# EAGLE schematic led-matrix-displayCompl (EAGLE 5.12)
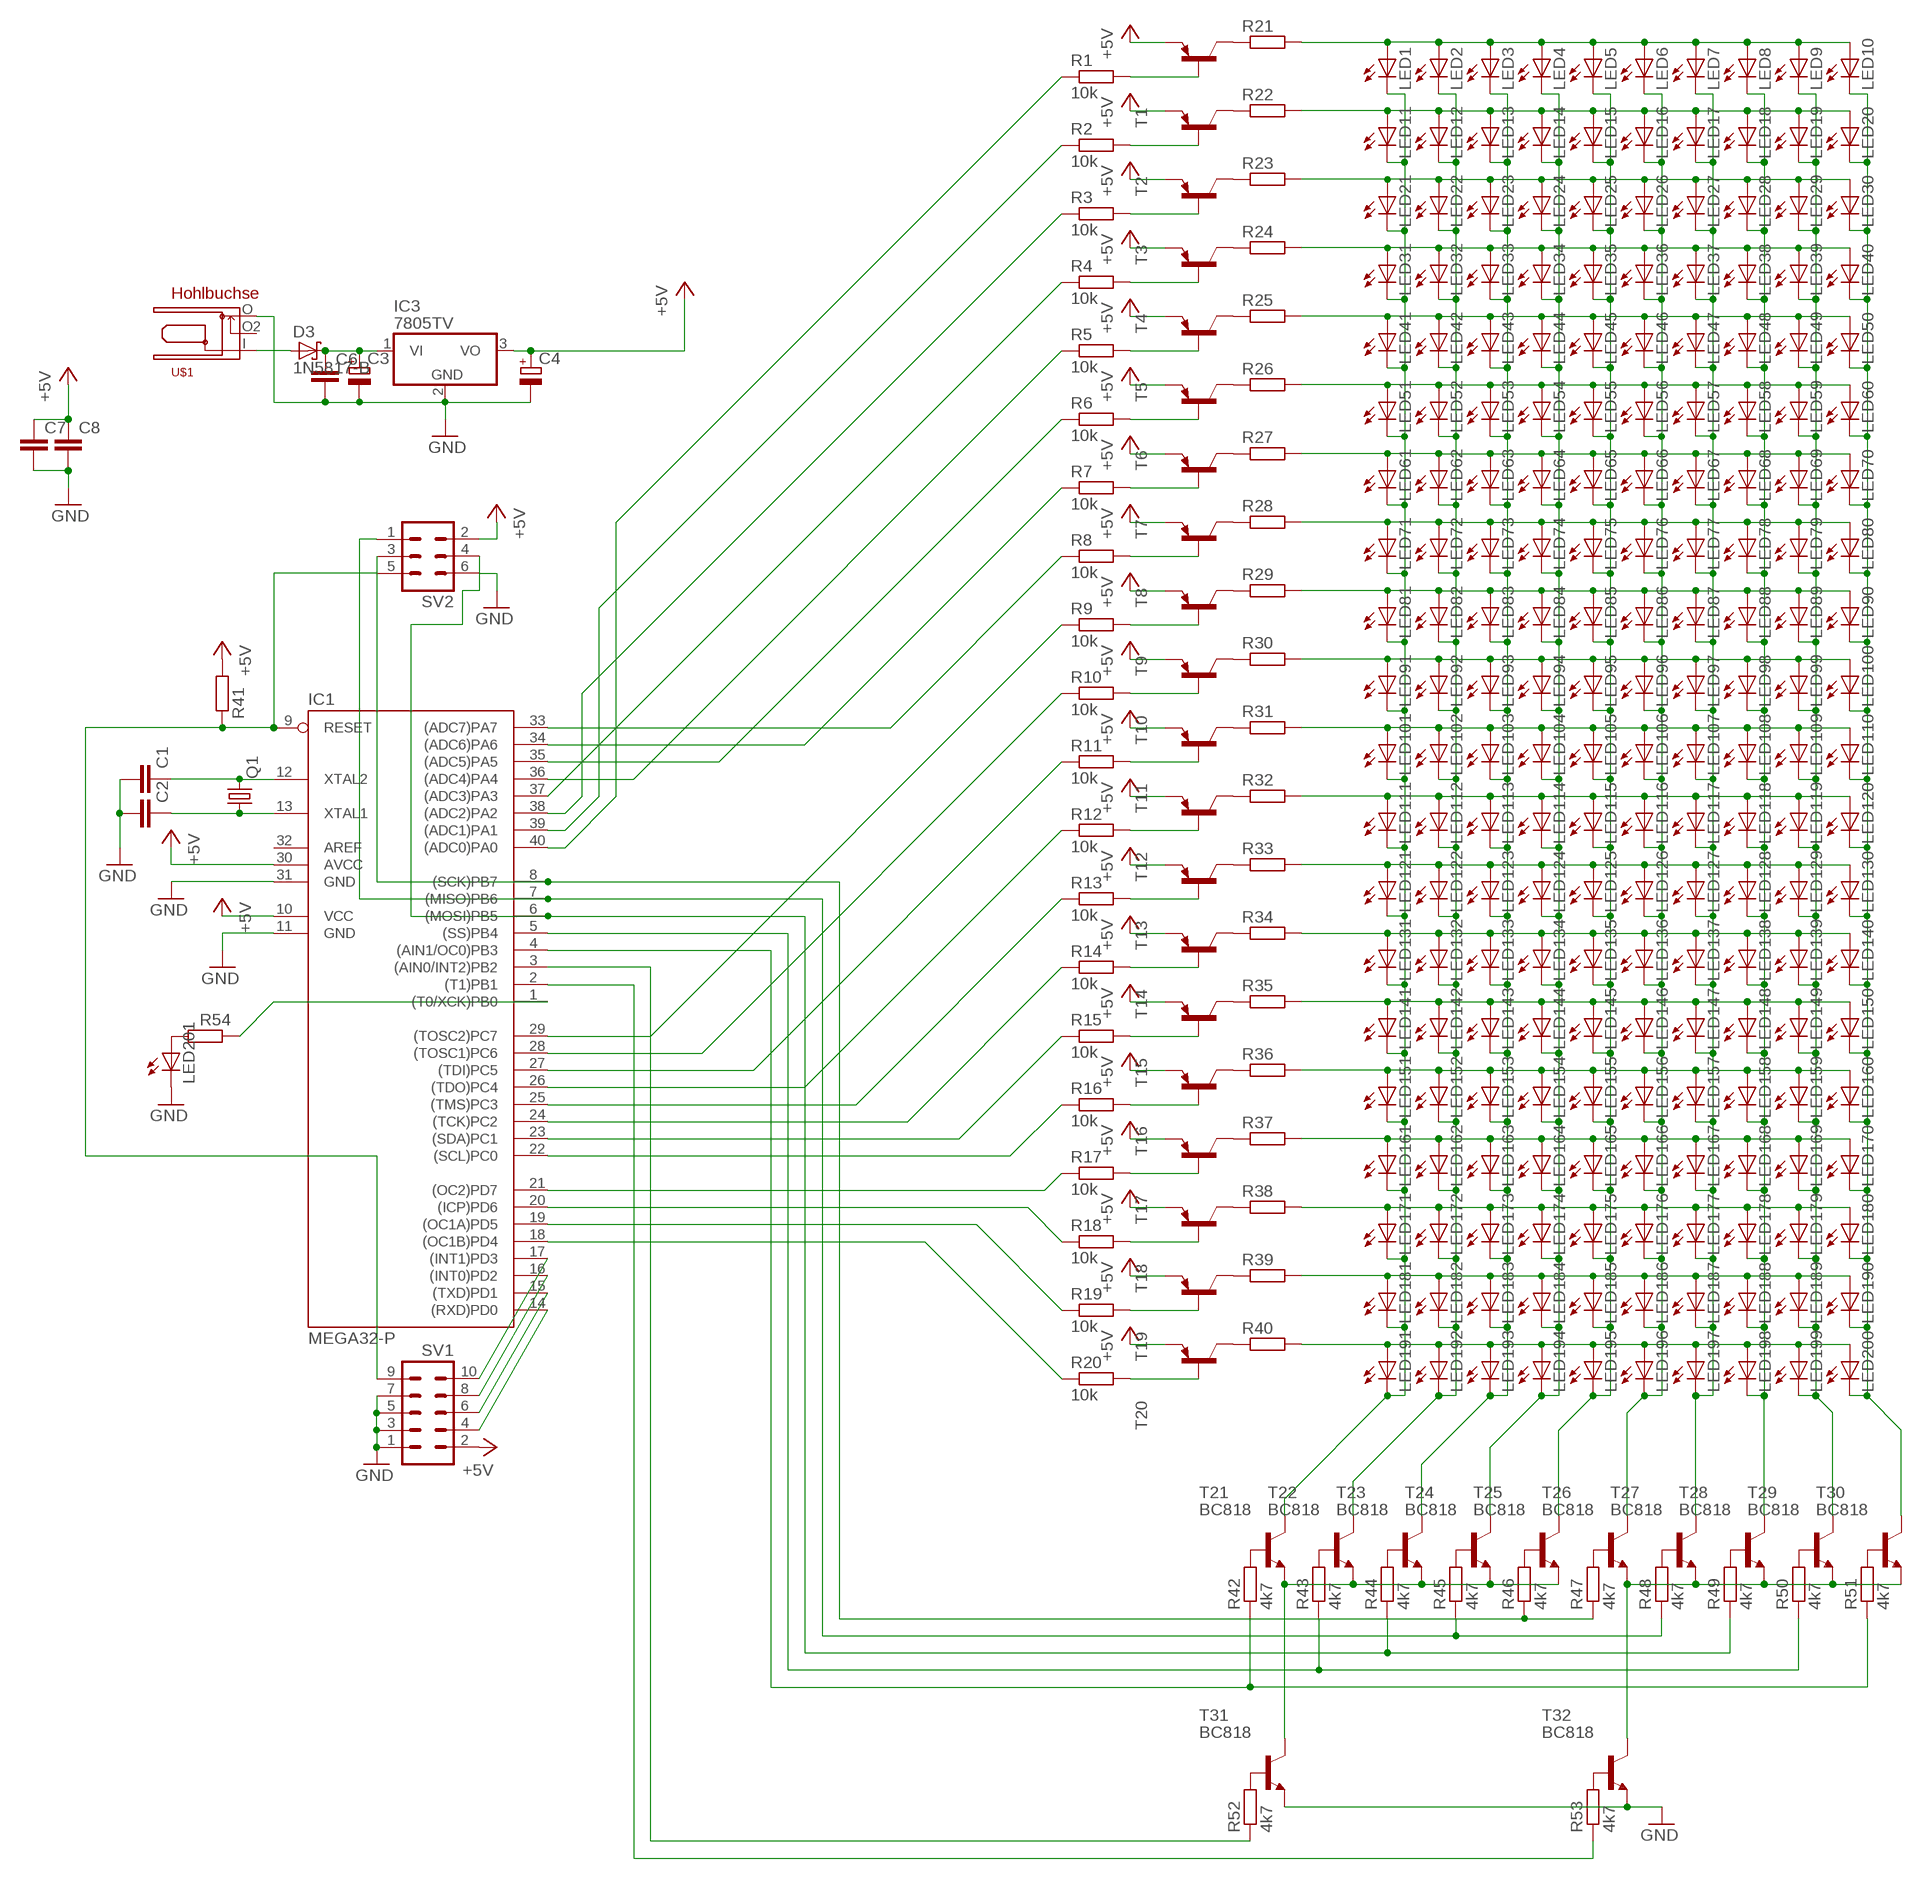
[diagram p0: schematic, sheet 1]

## Parts
C1  C-EUC0805  [C0805]
C2  C-EUC0805  [C0805]
C3  CPOL-EUE2.5-5  [E2,5-5]
C4  CPOL-EUE2.5-5  [E2,5-5]
C6  C-EUC1812K  [C1812K]
C7  C-EUC1812K  [C1812K]
C8  C-EUC1812K  [C1812K]
D3  1N5817-B  [DO41-7.6]
IC1  MEGA32-P  [DIL40]
IC3  7805TV  [TO220V]
LED1  LED3MM  [LED3MM]
LED2  LED3MM  [LED3MM]
LED3  LED3MM  [LED3MM]
LED4  LED3MM  [LED3MM]
LED5  LED3MM  [LED3MM]
LED6  LED3MM  [LED3MM]
LED7  LED3MM  [LED3MM]
LED8  LED3MM  [LED3MM]
LED9  LED3MM  [LED3MM]
LED10  LED3MM  [LED3MM]
LED11  LED3MM  [LED3MM]
LED12  LED3MM  [LED3MM]
LED13  LED3MM  [LED3MM]
LED14  LED3MM  [LED3MM]
LED15  LED3MM  [LED3MM]
LED16  LED3MM  [LED3MM]
LED17  LED3MM  [LED3MM]
LED18  LED3MM  [LED3MM]
LED19  LED3MM  [LED3MM]
LED20  LED3MM  [LED3MM]
LED21  LED3MM  [LED3MM]
LED22  LED3MM  [LED3MM]
LED23  LED3MM  [LED3MM]
LED24  LED3MM  [LED3MM]
LED25  LED3MM  [LED3MM]
LED26  LED3MM  [LED3MM]
LED27  LED3MM  [LED3MM]
LED28  LED3MM  [LED3MM]
LED29  LED3MM  [LED3MM]
LED30  LED3MM  [LED3MM]
LED31  LED3MM  [LED3MM]
LED32  LED3MM  [LED3MM]
LED33  LED3MM  [LED3MM]
LED34  LED3MM  [LED3MM]
LED35  LED3MM  [LED3MM]
LED36  LED3MM  [LED3MM]
LED37  LED3MM  [LED3MM]
LED38  LED3MM  [LED3MM]
LED39  LED3MM  [LED3MM]
LED40  LED3MM  [LED3MM]
LED41  LED3MM  [LED3MM]
LED42  LED3MM  [LED3MM]
LED43  LED3MM  [LED3MM]
LED44  LED3MM  [LED3MM]
LED45  LED3MM  [LED3MM]
LED46  LED3MM  [LED3MM]
LED47  LED3MM  [LED3MM]
LED48  LED3MM  [LED3MM]
LED49  LED3MM  [LED3MM]
LED50  LED3MM  [LED3MM]
LED51  LED3MM  [LED3MM]
LED52  LED3MM  [LED3MM]
LED53  LED3MM  [LED3MM]
LED54  LED3MM  [LED3MM]
LED55  LED3MM  [LED3MM]
LED56  LED3MM  [LED3MM]
LED57  LED3MM  [LED3MM]
LED58  LED3MM  [LED3MM]
LED59  LED3MM  [LED3MM]
LED60  LED3MM  [LED3MM]
LED61  LED3MM  [LED3MM]
LED62  LED3MM  [LED3MM]
LED63  LED3MM  [LED3MM]
LED64  LED3MM  [LED3MM]
LED65  LED3MM  [LED3MM]
LED66  LED3MM  [LED3MM]
LED67  LED3MM  [LED3MM]
LED68  LED3MM  [LED3MM]
LED69  LED3MM  [LED3MM]
LED70  LED3MM  [LED3MM]
LED71  LED3MM  [LED3MM]
LED72  LED3MM  [LED3MM]
LED73  LED3MM  [LED3MM]
LED74  LED3MM  [LED3MM]
LED75  LED3MM  [LED3MM]
LED76  LED3MM  [LED3MM]
LED77  LED3MM  [LED3MM]
LED78  LED3MM  [LED3MM]
LED79  LED3MM  [LED3MM]
LED80  LED3MM  [LED3MM]
LED81  LED3MM  [LED3MM]
LED82  LED3MM  [LED3MM]
LED83  LED3MM  [LED3MM]
LED84  LED3MM  [LED3MM]
LED85  LED3MM  [LED3MM]
LED86  LED3MM  [LED3MM]
LED87  LED3MM  [LED3MM]
LED88  LED3MM  [LED3MM]
LED89  LED3MM  [LED3MM]
LED90  LED3MM  [LED3MM]
LED91  LED3MM  [LED3MM]
LED92  LED3MM  [LED3MM]
LED93  LED3MM  [LED3MM]
LED94  LED3MM  [LED3MM]
LED95  LED3MM  [LED3MM]
LED96  LED3MM  [LED3MM]
LED97  LED3MM  [LED3MM]
LED98  LED3MM  [LED3MM]
LED99  LED3MM  [LED3MM]
LED100  LED3MM  [LED3MM]
LED101  LED3MM  [LED3MM]
LED102  LED3MM  [LED3MM]
LED103  LED3MM  [LED3MM]
LED104  LED3MM  [LED3MM]
LED105  LED3MM  [LED3MM]
LED106  LED3MM  [LED3MM]
LED107  LED3MM  [LED3MM]
LED108  LED3MM  [LED3MM]
LED109  LED3MM  [LED3MM]
LED110  LED3MM  [LED3MM]
LED111  LED3MM  [LED3MM]
LED112  LED3MM  [LED3MM]
LED113  LED3MM  [LED3MM]
LED114  LED3MM  [LED3MM]
LED115  LED3MM  [LED3MM]
LED116  LED3MM  [LED3MM]
LED117  LED3MM  [LED3MM]
LED118  LED3MM  [LED3MM]
LED119  LED3MM  [LED3MM]
LED120  LED3MM  [LED3MM]
LED121  LED3MM  [LED3MM]
LED122  LED3MM  [LED3MM]
LED123  LED3MM  [LED3MM]
LED124  LED3MM  [LED3MM]
LED125  LED3MM  [LED3MM]
LED126  LED3MM  [LED3MM]
LED127  LED3MM  [LED3MM]
LED128  LED3MM  [LED3MM]
LED129  LED3MM  [LED3MM]
LED130  LED3MM  [LED3MM]
LED131  LED3MM  [LED3MM]
LED132  LED3MM  [LED3MM]
LED133  LED3MM  [LED3MM]
LED134  LED3MM  [LED3MM]
LED135  LED3MM  [LED3MM]
LED136  LED3MM  [LED3MM]
LED137  LED3MM  [LED3MM]
LED138  LED3MM  [LED3MM]
LED139  LED3MM  [LED3MM]
LED140  LED3MM  [LED3MM]
LED141  LED3MM  [LED3MM]
LED142  LED3MM  [LED3MM]
LED143  LED3MM  [LED3MM]
LED144  LED3MM  [LED3MM]
LED145  LED3MM  [LED3MM]
LED146  LED3MM  [LED3MM]
LED147  LED3MM  [LED3MM]
LED148  LED3MM  [LED3MM]
LED149  LED3MM  [LED3MM]
LED150  LED3MM  [LED3MM]
LED151  LED3MM  [LED3MM]
LED152  LED3MM  [LED3MM]
LED153  LED3MM  [LED3MM]
LED154  LED3MM  [LED3MM]
LED155  LED3MM  [LED3MM]
LED156  LED3MM  [LED3MM]
LED157  LED3MM  [LED3MM]
LED158  LED3MM  [LED3MM]
LED159  LED3MM  [LED3MM]
LED160  LED3MM  [LED3MM]
LED161  LED3MM  [LED3MM]
LED162  LED3MM  [LED3MM]
LED163  LED3MM  [LED3MM]
LED164  LED3MM  [LED3MM]
LED165  LED3MM  [LED3MM]
LED166  LED3MM  [LED3MM]
LED167  LED3MM  [LED3MM]
LED168  LED3MM  [LED3MM]
LED169  LED3MM  [LED3MM]
LED170  LED3MM  [LED3MM]
LED171  LED3MM  [LED3MM]
LED172  LED3MM  [LED3MM]
LED173  LED3MM  [LED3MM]
LED174  LED3MM  [LED3MM]
LED175  LED3MM  [LED3MM]
LED176  LED3MM  [LED3MM]
LED177  LED3MM  [LED3MM]
LED178  LED3MM  [LED3MM]
LED179  LED3MM  [LED3MM]
LED180  LED3MM  [LED3MM]
LED181  LED3MM  [LED3MM]
LED182  LED3MM  [LED3MM]
LED183  LED3MM  [LED3MM]
LED184  LED3MM  [LED3MM]
LED185  LED3MM  [LED3MM]
LED186  LED3MM  [LED3MM]
LED187  LED3MM  [LED3MM]
LED188  LED3MM  [LED3MM]
LED189  LED3MM  [LED3MM]
LED190  LED3MM  [LED3MM]
LED191  LED3MM  [LED3MM]
LED192  LED3MM  [LED3MM]
LED193  LED3MM  [LED3MM]
LED194  LED3MM  [LED3MM]
LED195  LED3MM  [LED3MM]
LED196  LED3MM  [LED3MM]
LED197  LED3MM  [LED3MM]
LED198  LED3MM  [LED3MM]
LED199  LED3MM  [LED3MM]
LED200  LED3MM  [LED3MM]
LED201  LED5MM  [LED5MM]
Q1  CRYSTALHC49UP  [HC49UP]
R1  10k  R-EU_R0805  [R0805]
R2  10k  R-EU_R0805  [R0805]
R3  10k  R-EU_R0805  [R0805]
R4  10k  R-EU_R0805  [R0805]
R5  10k  R-EU_R0805  [R0805]
R6  10k  R-EU_R0805  [R0805]
R7  10k  R-EU_R0805  [R0805]
R8  10k  R-EU_R0805  [R0805]
R9  10k  R-EU_R0805  [R0805]
R10  10k  R-EU_R0805  [R0805]
R11  10k  R-EU_R0805  [R0805]
R12  10k  R-EU_R0805  [R0805]
R13  10k  R-EU_R0805  [R0805]
R14  10k  R-EU_R0805  [R0805]
R15  10k  R-EU_R0805  [R0805]
R16  10k  R-EU_R0805  [R0805]
R17  10k  R-EU_R0805  [R0805]
R18  10k  R-EU_R0805  [R0805]
R19  10k  R-EU_R0805  [R0805]
R20  10k  R-EU_R0805  [R0805]
R21  R-EU_R1206  [R1206]
R22  R-EU_R1206  [R1206]
R23  R-EU_R1206  [R1206]
R24  R-EU_R1206  [R1206]
R25  R-EU_R1206  [R1206]
R26  R-EU_R1206  [R1206]
R27  R-EU_R1206  [R1206]
R28  R-EU_R1206  [R1206]
R29  R-EU_R1206  [R1206]
R30  R-EU_R1206  [R1206]
R31  R-EU_R1206  [R1206]
R32  R-EU_R1206  [R1206]
R33  R-EU_R1206  [R1206]
R34  R-EU_R1206  [R1206]
R35  R-EU_R1206  [R1206]
R36  R-EU_R1206  [R1206]
R37  R-EU_R1206  [R1206]
R38  R-EU_R1206  [R1206]
R39  R-EU_R1206  [R1206]
R40  R-EU_R1206  [R1206]
R41  R-EU_R0805  [R0805]
R42  4k7  R-EU_R1206  [R1206]
R43  4k7  R-EU_R1206  [R1206]
R44  4k7  R-EU_R1206  [R1206]
R45  4k7  R-EU_R1206  [R1206]
R46  4k7  R-EU_R1206  [R1206]
R47  4k7  R-EU_R1206  [R1206]
R48  4k7  R-EU_R1206  [R1206]
R49  4k7  R-EU_R1206  [R1206]
R50  4k7  R-EU_R1206  [R1206]
R51  4k7  R-EU_R1206  [R1206]
R52  4k7  R-EU_R1206  [R1206]
R53  4k7  R-EU_R1206  [R1206]
R54  R-EU_R0805  [R0805]
SV1  ML10  [ML10]
SV2  ML6  [ML6]
T1  BC856A-PNP-SOT23-BEC  [SOT23-BEC]
T2  BC856A-PNP-SOT23-BEC  [SOT23-BEC]
T3  BC856A-PNP-SOT23-BEC  [SOT23-BEC]
T4  BC856A-PNP-SOT23-BEC  [SOT23-BEC]
T5  BC856A-PNP-SOT23-BEC  [SOT23-BEC]
T6  BC856A-PNP-SOT23-BEC  [SOT23-BEC]
T7  BC856A-PNP-SOT23-BEC  [SOT23-BEC]
T8  BC856A-PNP-SOT23-BEC  [SOT23-BEC]
T9  BC856A-PNP-SOT23-BEC  [SOT23-BEC]
T10  BC856A-PNP-SOT23-BEC  [SOT23-BEC]
T11  BC856A-PNP-SOT23-BEC  [SOT23-BEC]
T12  BC856A-PNP-SOT23-BEC  [SOT23-BEC]
T13  BC856A-PNP-SOT23-BEC  [SOT23-BEC]
T14  BC856A-PNP-SOT23-BEC  [SOT23-BEC]
T15  BC856A-PNP-SOT23-BEC  [SOT23-BEC]
T16  BC856A-PNP-SOT23-BEC  [SOT23-BEC]
T17  BC856A-PNP-SOT23-BEC  [SOT23-BEC]
T18  BC856A-PNP-SOT23-BEC  [SOT23-BEC]
T19  BC856A-PNP-SOT23-BEC  [SOT23-BEC]
T20  BC856A-PNP-SOT23-BEC  [SOT23-BEC]
T21  BC818  BC850  [SOT23]
T22  BC818  BC850  [SOT23]
T23  BC818  BC850  [SOT23]
T24  BC818  BC850  [SOT23]
T25  BC818  BC850  [SOT23]
T26  BC818  BC850  [SOT23]
T27  BC818  BC850  [SOT23]
T28  BC818  BC850  [SOT23]
T29  BC818  BC850  [SOT23]
T30  BC818  BC850  [SOT23]
T31  BC818  BC850  [SOT23]
T32  BC818  BC850  [SOT23]
U$1  HOHLBUCHSE  [HOHLBUCHSE]

## Nets
+5V: C4.+ C7.1 C8.1 IC1.10(VCC) IC1.30(AVCC) IC3.3(VO) R41.2 SV1.2 SV2.2 T1.E T2.E T3.E T4.E T5.E T6.E T7.E T8.E T9.E T10.E T11.E T12.E T13.E T14.E T15.E T16.E T17.E T18.E T19.E T20.E
GND: C1.2 C2.2 C3.- C4.- C6.2 C7.2 C8.2 IC1.11(GND) IC1.31(GND) IC3.2(GND) LED201.K(C) SV1.1 SV1.3 SV1.5 SV1.7 SV2.6 T31.2(E) T32.2(E) U$1.O
N$1: LED1.A LED2.A LED3.A LED4.A LED5.A LED6.A LED7.A LED8.A LED9.A LED10.A R21.2
N$2: LED11.A LED12.A LED13.A LED14.A LED15.A LED16.A LED17.A LED18.A LED19.A LED20.A R22.2
N$3: LED21.A LED22.A LED23.A LED24.A LED25.A LED26.A LED27.A LED28.A LED29.A LED30.A R23.2
N$4: LED31.A LED32.A LED33.A LED34.A LED35.A LED36.A LED37.A LED38.A LED39.A LED40.A R24.2
N$5: LED41.A LED42.A LED43.A LED44.A LED45.A LED46.A LED47.A LED48.A LED49.A LED50.A R25.2
N$6: LED51.A LED52.A LED53.A LED54.A LED55.A LED56.A LED57.A LED58.A LED59.A LED60.A R26.2
N$7: LED61.A LED62.A LED63.A LED64.A LED65.A LED66.A LED67.A LED68.A LED69.A LED70.A R27.2
N$8: LED71.A LED72.A LED73.A LED74.A LED75.A LED76.A LED77.A LED78.A LED79.A LED80.A R28.2
N$9: LED81.A LED82.A LED83.A LED84.A LED85.A LED86.A LED87.A LED88.A LED89.A LED90.A R29.2
N$10: LED91.A LED92.A LED93.A LED94.A LED95.A LED96.A LED97.A LED98.A LED99.A LED100.A R30.2
N$11: LED101.A LED102.A LED103.A LED104.A LED105.A LED106.A LED107.A LED108.A LED109.A LED110.A R31.2
N$12: LED111.A LED112.A LED113.A LED114.A LED115.A LED116.A LED117.A LED118.A LED119.A LED120.A R32.2
N$13: LED121.A LED122.A LED123.A LED124.A LED125.A LED126.A LED127.A LED128.A LED129.A LED130.A R33.2
N$14: IC1.9(RESET) R41.1 SV1.9 SV2.5
N$15: LED141.A LED142.A LED143.A LED144.A LED145.A LED146.A LED147.A LED148.A LED149.A LED150.A R35.2
N$16: LED151.A LED152.A LED153.A LED154.A LED155.A LED156.A LED157.A LED158.A LED159.A LED160.A R36.2
N$17: LED161.A LED162.A LED163.A LED164.A LED165.A LED166.A LED167.A LED168.A LED169.A LED170.A R37.2
N$18: IC1.18((OC1B)PD4) R20.1
N$19: LED181.A LED182.A LED183.A LED184.A LED185.A LED186.A LED187.A LED188.A LED189.A LED190.A R39.2
N$20: IC1.19((OC1A)PD5) R19.1
N$21: LED1.K(C) LED11.K(C) LED21.K(C) LED31.K(C) LED41.K(C) LED51.K(C) LED61.K(C) LED71.K(C) LED81.K(C) LED91.K(C) LED101.K(C) LED111.K(C) LED121.K(C) LED131.K(C) LED141.K(C) LED151.K(C) LED161.K(C) LED171.K(C) LED181.K(C) LED191.K(C) T21.3(C)
N$22: LED2.K(C) LED12.K(C) LED22.K(C) LED32.K(C) LED42.K(C) LED52.K(C) LED62.K(C) LED72.K(C) LED82.K(C) LED92.K(C) LED102.K(C) LED112.K(C) LED122.K(C) LED132.K(C) LED142.K(C) LED152.K(C) LED162.K(C) LED172.K(C) LED182.K(C) LED192.K(C) T22.3(C)
N$23: LED3.K(C) LED13.K(C) LED23.K(C) LED33.K(C) LED43.K(C) LED53.K(C) LED63.K(C) LED73.K(C) LED83.K(C) LED93.K(C) LED103.K(C) LED113.K(C) LED123.K(C) LED133.K(C) LED143.K(C) LED153.K(C) LED163.K(C) LED173.K(C) LED183.K(C) LED193.K(C) T23.3(C)
N$24: LED4.K(C) LED14.K(C) LED24.K(C) LED34.K(C) LED44.K(C) LED54.K(C) LED64.K(C) LED74.K(C) LED84.K(C) LED94.K(C) LED104.K(C) LED114.K(C) LED124.K(C) LED134.K(C) LED144.K(C) LED154.K(C) LED164.K(C) LED174.K(C) LED184.K(C) LED194.K(C) T24.3(C)
N$25: LED5.K(C) LED15.K(C) LED25.K(C) LED35.K(C) LED45.K(C) LED55.K(C) LED65.K(C) LED75.K(C) LED85.K(C) LED95.K(C) LED105.K(C) LED115.K(C) LED125.K(C) LED135.K(C) LED145.K(C) LED155.K(C) LED165.K(C) LED175.K(C) LED185.K(C) LED195.K(C) T25.3(C)
N$26: LED6.K(C) LED16.K(C) LED26.K(C) LED36.K(C) LED46.K(C) LED56.K(C) LED66.K(C) LED76.K(C) LED86.K(C) LED96.K(C) LED106.K(C) LED116.K(C) LED126.K(C) LED136.K(C) LED146.K(C) LED156.K(C) LED166.K(C) LED176.K(C) LED186.K(C) LED196.K(C) T26.3(C)
N$27: LED7.K(C) LED17.K(C) LED27.K(C) LED37.K(C) LED47.K(C) LED57.K(C) LED67.K(C) LED77.K(C) LED87.K(C) LED97.K(C) LED107.K(C) LED117.K(C) LED127.K(C) LED137.K(C) LED147.K(C) LED157.K(C) LED167.K(C) LED177.K(C) LED187.K(C) LED197.K(C) T27.3(C)
N$28: LED8.K(C) LED18.K(C) LED28.K(C) LED38.K(C) LED48.K(C) LED58.K(C) LED68.K(C) LED78.K(C) LED88.K(C) LED98.K(C) LED108.K(C) LED118.K(C) LED128.K(C) LED138.K(C) LED148.K(C) LED158.K(C) LED168.K(C) LED178.K(C) LED188.K(C) LED198.K(C) T28.3(C)
N$29: LED9.K(C) LED19.K(C) LED29.K(C) LED39.K(C) LED49.K(C) LED59.K(C) LED69.K(C) LED79.K(C) LED89.K(C) LED99.K(C) LED109.K(C) LED119.K(C) LED129.K(C) LED139.K(C) LED149.K(C) LED159.K(C) LED169.K(C) LED179.K(C) LED189.K(C) LED199.K(C) T29.3(C)
N$30: LED10.K(C) LED20.K(C) LED30.K(C) LED40.K(C) LED50.K(C) LED60.K(C) LED70.K(C) LED80.K(C) LED90.K(C) LED100.K(C) LED110.K(C) LED120.K(C) LED130.K(C) LED140.K(C) LED150.K(C) LED160.K(C) LED170.K(C) LED180.K(C) LED190.K(C) LED200.K(C) T30.3(C)
N$31: R1.2 T1.B
N$32: R2.2 T2.B
N$33: R3.2 T3.B
N$34: R4.2 T4.B
N$35: R5.2 T5.B
N$36: R6.2 T6.B
N$37: R7.2 T7.B
N$38: R8.2 T8.B
N$39: R9.2 T9.B
N$40: R10.2 T10.B
N$41: R11.2 T11.B
N$42: R12.2 T12.B
N$43: R13.2 T13.B
N$44: R14.2 T14.B
N$45: R15.2 T15.B
N$46: R16.2 T16.B
N$47: R17.2 T17.B
N$48: R18.2 T18.B
N$49: R19.2 T19.B
N$50: R20.2 T20.B
N$51: R21.1 T1.C
N$52: R26.1 T6.C
N$53: R22.1 T2.C
N$54: R23.1 T3.C
N$55: R24.1 T4.C
N$56: R25.1 T5.C
N$57: R27.1 T7.C
N$58: R28.1 T8.C
N$59: R29.1 T9.C
N$60: R30.1 T10.C
N$61: R31.1 T11.C
N$62: R32.1 T12.C
N$63: R33.1 T13.C
N$64: R34.1 T14.C
N$65: R35.1 T15.C
N$66: R36.1 T16.C
N$67: R37.1 T17.C
N$68: R38.1 T18.C
N$69: R39.1 T19.C
N$70: R40.1 T20.C
N$71: LED191.A LED192.A LED193.A LED194.A LED195.A LED196.A LED197.A LED198.A LED199.A LED200.A R40.2
N$72: LED171.A LED172.A LED173.A LED174.A LED175.A LED176.A LED177.A LED178.A LED179.A LED180.A R38.2
N$73: LED131.A LED132.A LED133.A LED134.A LED135.A LED136.A LED137.A LED138.A LED139.A LED140.A R34.2
N$74: IC1.6((MOSI)PB5) R44.1 R49.1 SV2.4
N$75: IC1.7((MISO)PB6) R45.1 R48.1 SV2.1
N$76: IC1.20((ICP)PD6) R18.1
N$77: IC1.21((OC2)PD7) R17.1
N$78: IC1.8((SCK)PB7) R46.1 R47.1 SV2.3
N$79: IC1.22((SCL)PC0) R16.1
N$80: C1.1 IC1.12(XTAL2) Q1.2
N$81: C2.1 IC1.13(XTAL1) Q1.1
N$82: IC1.14((RXD)PD0) SV1.4
N$83: IC1.15((TXD)PD1) SV1.6
N$84: IC1.16((INT0)PD2) SV1.8
N$85: IC1.17((INT1)PD3) SV1.10
N$86: IC1.23((SDA)PC1) R15.1
N$87: IC1.24((TCK)PC2) R14.1
N$88: IC1.25((TMS)PC3) R13.1
N$89: IC1.26((TDO)PC4) R12.1
N$90: IC1.27((TDI)PC5) R11.1
N$91: IC1.28((TOSC1)PC6) R10.1
N$92: C3.+ C6.1 D3.C IC3.1(VI)
N$93: D3.A U$1.I
N$94: R42.2 T21.1(B)
N$95: IC1.29((TOSC2)PC7) R9.1
N$96: IC1.33((ADC7)PA7) R8.1
N$97: IC1.34((ADC6)PA6) R7.1
N$98: IC1.35((ADC5)PA5) R6.1
N$99: IC1.36((ADC4)PA4) R5.1
N$100: IC1.37((ADC3)PA3) R4.1
N$101: IC1.38((ADC2)PA2) R3.1
N$102: IC1.39((ADC1)PA1) R2.1
N$103: IC1.40((ADC0)PA0) R1.1
N$104: R43.2 T22.1(B)
N$105: R44.2 T23.1(B)
N$106: R45.2 T24.1(B)
N$107: R46.2 T25.1(B)
N$108: R47.2 T26.1(B)
N$109: R48.2 T27.1(B)
N$110: R49.2 T28.1(B)
N$111: R50.2 T29.1(B)
N$112: R51.2 T30.1(B)
N$113: R52.2 T31.1(B)
N$114: R53.2 T32.1(B)
N$115: IC1.3((AIN0/INT2)PB2) R52.1
N$116: IC1.5((SS)PB4) R43.1 R50.1
N$117: IC1.4((AIN1/OC0)PB3) R42.1 R51.1
N$118: T21.2(E) T22.2(E) T23.2(E) T24.2(E) T25.2(E) T31.3(C)
N$119: T26.2(E) T27.2(E) T28.2(E) T29.2(E) T30.2(E) T32.3(C)
N$120: IC1.2((T1)PB1) R53.1
N$121: LED201.A R54.2
N$122: IC1.1((T0/XCK)PB0) R54.1
Unconnected: IC1.32(AREF) U$1.O2

## Library data of the parts
C1 C2 C6-C8 = rcl:C-EU: CAPACITOR, European symbol
C3 C4 = rcl:CPOL-EU: POLARIZED CAPACITOR, European symbol
D3 = diode:1N581*: 1.0A SCHOTTKY BARRIER RECTIFIER Source: http://www.diodes.com/datasheets/ds23001.pdf
IC1 = atmel:MEGA32-P: MICROCONTROLLER 32 Kbytes FLASH 2 Kbytes SRAM 1 Kbytes EEPROM USART 8-channel 10 bit ADC Source: www.atmel.com .. doc2503.pdf; MPN: ATMEGA32-16PU; OC_FARNELL: 1661729; OC_NEWARK: 51P1794
IC3 = linear:78*: Positive VOLTAGE REGULATOR Source: http://cache.national.com/ds/LM/LM78L05.pdf http://www.fairchildsemi.com/ds/LM/LM7805.pdf
LED1-LED201 = led:LED: LED OSRAM: - CHIPLED LG R971, LG N971, LY N971, LG Q971, LY Q971, LO R971, LY R971 LH N974, LH R974 LS Q976, LO Q976, LY Q976 LO Q996 - Hyper CHIPLED LW Q18S LB Q993, LB Q99A, LB R99A - SideLED LS A670, LO A670, LY A670, LG A670, LP A670 LB A673, LV A673, LT A673, LW A673 LH A674 LY A675 LS A676, LA A676, LO A676, LY A676, LW A676 LS A679, LY A679, LG A679 - Hyper Micro SIDELED® LS Y876, LA Y876, LO Y876, LY Y876 LT Y87S - SmartLED LW L88C, LW L88S LB L89C, LB L89S, LG L890 LS L89K, LO L89K, LY L89K LS L896, LA L896, LO L896, LY L896 - TOPLED LS T670, LO T670, LY T670, LG T670, LP T670 LSG T670, LSP T670, LSY T670, LOP T670, LYG T670 LG T671, LOG T671, LSG T671 LB T673, LV T673, LT T673, LW T673 LH T674 LS T676, LA T676, LO T676, LY T676, LB T676, LH T676, LSB T676, LW T676 LB T67C, LV T67C, LT T67C, LS T67K, LO T67K, LY T67K, LW E67C LS E67B, LA E67B, LO E67B, LY E67B, LB E67C, LV E67C, LT E67C LW T67C LS T679, LY T679, LG T679 LS T770, LO T770, LY T770, LG T770, LP T770 LB T773, LV T773, LT T773, LW T773 LH T774 LS E675, LA E675, LY E675, LS T675 LS T776, LA T776, LO T776, LY T776, LB T776 LHGB T686 LT T68C, LB T68C - Hyper Mini TOPLED® LB M676 - Mini TOPLED Santana® LG M470 LS M47K, LO M47K, LY M47K Source: http://www.osram.convergy.de LUXEON: - LUMILED® LXK2-PW12-R00, LXK2-PW12-S00, LXK2-PW14-U00, LXK2-PW14-V00 LXK2-PM12-R00, LXK2-PM12-S00, LXK2-PM14-U00 LXK2-PE12-Q00, LXK2-PE12-R00, LXK2-PE12-S00, LXK2-PE14-T00, LXK2-PE14-U00 LXK2-PB12-K00, LXK2-PB12-L00, LXK2-PB12-M00, LXK2-PB14-N00, LXK2-PB14-P00, LXK2-PB14-Q00 LXK2-PR12-L00, LXK2-PR12-M00, LXK2-PR14-Q00, LXK2-PR14-R00 LXK2-PD12-Q00, LXK2-PD12-R00, LXK2-PD12-S00 LXK2-PH12-R00, LXK2-PH12-S00 LXK2-PL12-P00, LXK2-PL12-Q00, LXK2-PL12-R00 Source: www.luxeon.com KINGBRIGHT: KA-3528ASYC Source: www.kingbright.com
Q1 = crystal:CRYSTAL: CRYSTAL; OC_FARNELL: unknown; OC_NEWARK: unknown
R1-R54 = rcl:R-EU_: RESISTOR, European symbol
SV1 = con-harting-ml:ML10: HARTING; OC_FARNELL: unknown; OC_NEWARK: unknown
SV2 = con-ml:ML6: HARTING; OC_FARNELL: unknown; OC_NEWARK: unknown
T1-T20 = transistor:*-PNP-: PNP Transistror
T21-T32 = transistor:BC850: NPN TRANSISTOR
U$1 = smdTaster:HOHLBUCHSE